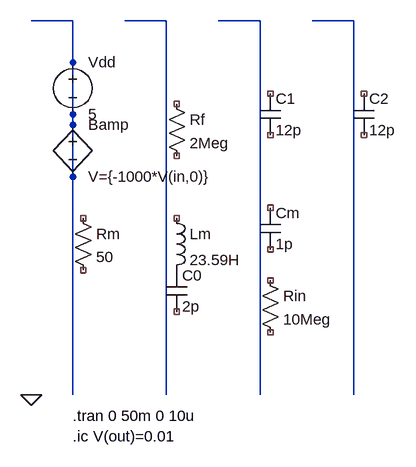
[diagram p0: schematic posc.asc]
posc.asc, the LTspice schematic file:
Version 4
SHEET 1 880 680
WIRE 64 48 0 48
WIRE 208 48 144 48
WIRE 352 48 288 48
WIRE 496 48 432 48
WIRE 64 128 64 48
WIRE 208 128 208 48
WIRE 352 128 352 48
WIRE 496 128 496 48
WIRE 64 192 64 128
WIRE 208 192 208 128
WIRE 352 192 352 128
WIRE 496 192 496 128
WIRE 64 240 64 192
WIRE 208 240 208 192
WIRE 352 240 352 192
WIRE 496 240 496 192
WIRE 64 288 64 240
WIRE 208 288 208 240
WIRE 352 288 352 240
WIRE 496 288 496 240
WIRE 64 336 64 288
WIRE 208 336 208 288
WIRE 352 336 352 288
WIRE 496 336 496 288
WIRE 64 384 64 336
WIRE 208 384 208 336
WIRE 352 384 352 336
WIRE 496 384 496 336
WIRE 64 432 64 384
WIRE 208 432 208 384
WIRE 352 432 352 384
WIRE 496 432 496 384
WIRE 64 480 64 432
WIRE 208 480 208 432
WIRE 352 480 352 432
WIRE 496 480 496 432
WIRE 64 528 64 480
WIRE 208 528 208 480
WIRE 352 528 352 480
WIRE 496 528 496 480
WIRE 64 576 64 528
WIRE 208 576 208 528
WIRE 352 576 352 528
WIRE 496 576 496 528
WIRE 64 624 64 576
WIRE 208 624 208 576
WIRE 352 624 352 576
WIRE 496 624 496 576
FLAG 0 624 0
SYMBOL voltage 64 96 R0
WINDOW 123 24 124 Left 2
SYMATTR InstName Vdd
SYMATTR Value 5
SYMBOL res 208 160 R0
SYMATTR InstName Rf
SYMATTR Value 2Meg
SYMBOL cap 352 160 R0
SYMATTR InstName C1
SYMATTR Value 12p
SYMBOL cap 496 160 R0
SYMATTR InstName C2
SYMATTR Value 12p
SYMBOL cap 352 336 R0
SYMATTR InstName Cm
SYMATTR Value 1p
SYMBOL ind 208 336 R0
SYMATTR InstName Lm
SYMATTR Value 23.59H
SYMBOL res 64 336 R0
SYMATTR InstName Rm
SYMATTR Value 50
SYMBOL cap 208 432 R0
SYMATTR InstName C0
SYMATTR Value 2p
SYMBOL res 352 432 R0
SYMATTR InstName Rin
SYMATTR Value 10Meg
SYMBOL bv 64 192 R0
SYMATTR InstName Bamp
SYMATTR Value V={-1000*V(in,0)}
TEXT 64 656 Left 2 !.tran 0 50m 0 10u
TEXT 64 688 Left 2 !.ic V(out)=0.01

The netlist it stands for:
* posc.asc
Vdd N001 N001 5
Rf NC_01 NC_02 2Meg
C1 NC_03 NC_04 12p
C2 NC_05 NC_06 12p
Cm NC_07 NC_08 1p
Lm NC_09 P001 23.59H
Rm NC_10 NC_11 50
C0 P001 NC_12 2p
Rin NC_13 NC_14 10Meg
Bamp N001 N001 V={-1000*V(in,0)}
.tran 0 50m 0 10u
.ic V(out)=0.01
.backanno
.end